# Altium project PCB_Project.PrjPcb
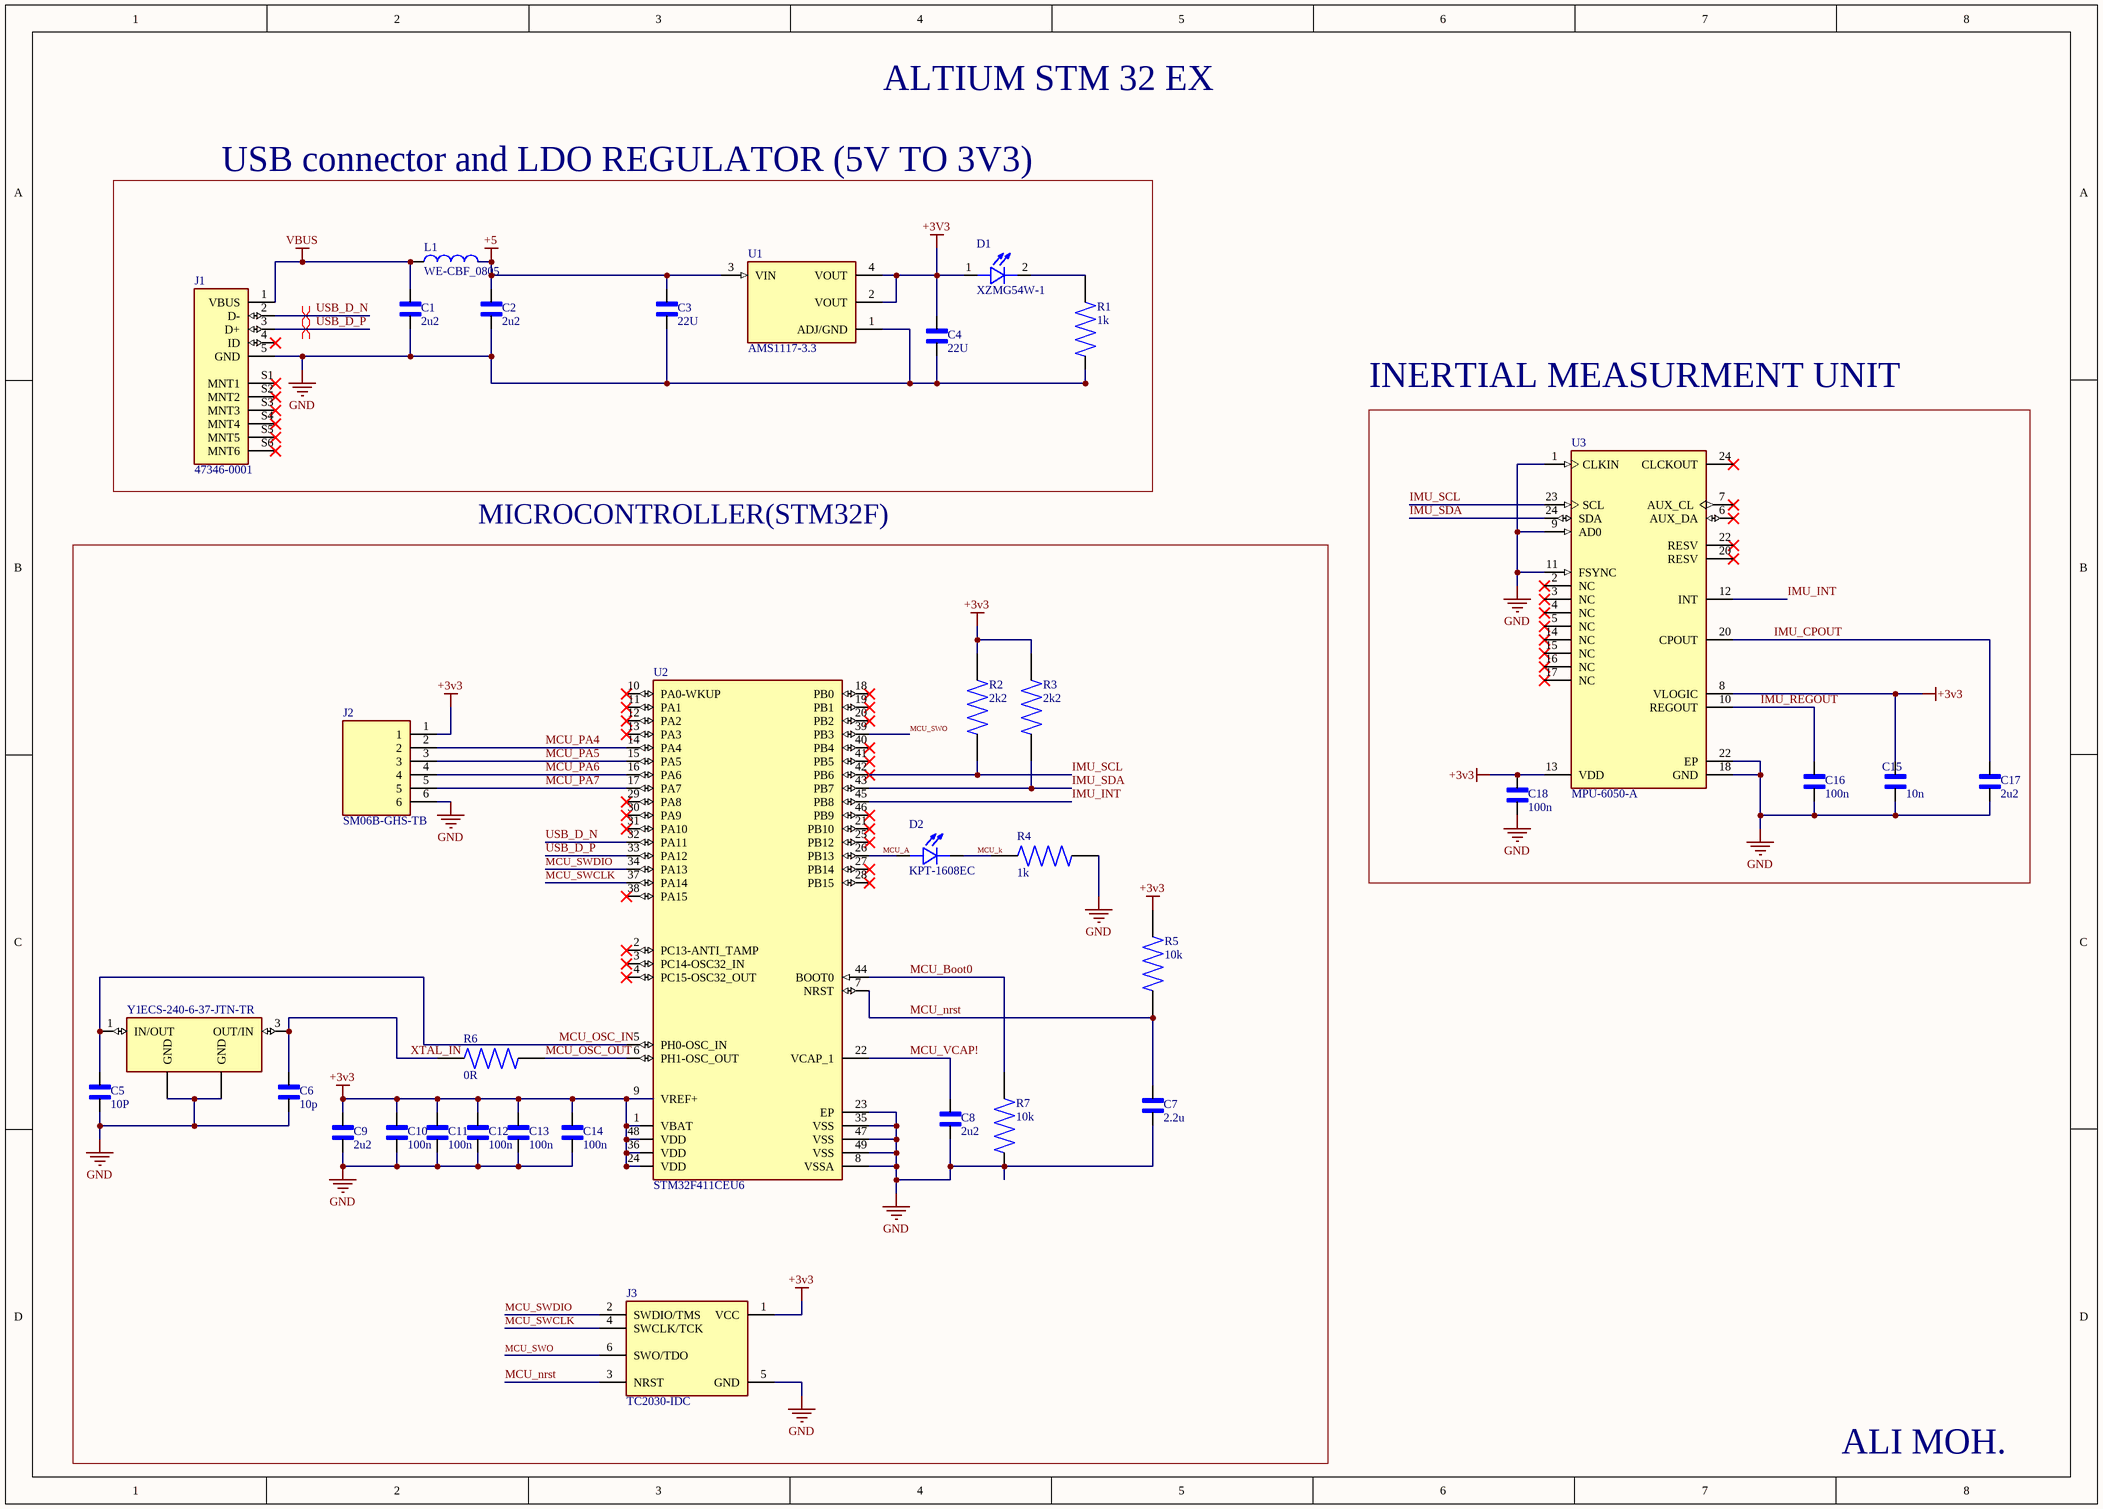
[diagram p0: Sheet1.SchDoc]
1 sheet, 35 parts. Net scope: global (net labels, ports and power ports of the same name join across sheets).
Board file: PCB1.PcbDoc

## Sheet Sheet1.SchDoc
size A3; SheetNumber: 1; SheetTotal: 1; SPICEModelCacheJLYBPXHK: <root> / <DocumentId>JLYBPXHK</DocumentId> / </root>

### Parts
C1  2u2  [CAPC1608X90]
C2  2u2  [CAPC1608X90]
C3  22U  [CAPC1608X90]
C4  22U  [CAPC1608X90]
C5  10P  [CAPC1608X90]
C6  10p  [CAPC1608X90]
C7  2.2u  [CAPC1608X90]
C8  2u2  [CAPC1608X90]
C9  2u2  [CAPC1608X90]
C10  100n  [CAPC1005X55N]
C11  100n  [CAPC1005X55N]
C12  100n  [CAPC1005X55N]
C13  100n  [CAPC1005X55N]
C14  100n  [CAPC1005X55N]
C15  10n  [CAPC1005X55N]
C16  100n  [CAPC1005X55N]
C17  2u2  [CAPC1608X90]
C18  100n  [CAPC1005X55N]
D1  XZMG54W-1  [LED_XZMG54W-1]
D2  KPT-1608EC  [LED_KPT-1608EC]
J1  47346-0001  [MOLEX_47346-0001]
J2  SM06B-GHS-TB  [JST_SM06B-GHS-TB]
J3  TC2030-IDC  [TAG-CONNECT_TC2050-IDC]
L1  WE-CBF_0805  [WE-CBF_0805_W4.0]
R1  1k  [RESC1005X37N]
R2  2k2  [RESC1005X37N]
R3  2k2  [RESC1005X37N]
R4  1k  [RESC1005X37N]
R5  10k  [RESC1005X37N]
R6  0R  [RESC1005X37N]
R7  10k  [RESC1005X37N]
U1  AMS1117-3.3  [SOT229P700X180-4N]
U2  STM32F411CEU6  [QFN50P700X700X60-49N]
U3  MPU-6050-A  [QFN50P400X400X95-24N]
Y1  ECS-240-6-37-JTN-TR  [XTAL_ECS-240-6-37-JTN-TR]

### Blocks framed on the sheet
USB connector and LDO REGULATOR (5V TO 3V3): C1-C4 D1 J1 L1 R1 U1
INERTIAL MEASURMENT UNIT: C15-C18 U3
MICROCONTROLLER(STM32F): C5-C14 D2 J2 J3 R2-R7 U2 Y1

### Nets
+3v3: C4.2 C9.2 C10.1 C11.1 C12.1 C13.1 C14.1 C15.1 C18.1 D1.1(A) J2.1 J3.1(VCC) R2.1 R3.1 R5.2 U1.2(VOUT) U1.4(VOUT) U2.1(VBAT) U2.9(VREF+) U2.24(VDD) U2.36(VDD) U2.48(VDD) U3.8(VLOGIC) U3.13(VDD)
+5: C2.2 C3.2 L1.2 U1.3(VIN)
GND: C1.1 C2.1 C3.1 C4.1 C5.1 C6.1 C7.1 C8.2 C9.1 C10.2 C11.2 C12.2 C13.2 C14.2 C15.2 C16.2 C17.2 C18.2 J1.5(GND) J2.6 J3.5(GND) R1.1 R4.1 R7.1 U1.1(ADJ/GND) U2.8(VSSA) U2.23(EP) U2.35(VSS) U2.47(VSS) U2.49(VSS) U3.1(CLKIN) U3.9(AD0) U3.11(FSYNC) U3.18(GND) U3.22(RESV) Y1.2(GND) Y1.4(GND)
VBUS: C1.2 J1.1(VBUS) L1.1
IMU_CPOUT: C17.1 U3.20(CPOUT)
IMU_INT: U2.45(PB8) U3.12(INT)
IMU_REGOUT: C16.1 U3.10(REGOUT)
IMU_SCL: R2.2 U2.42(PB6) U3.23(SCL)
IMU_SDA: R3.2 U2.43(PB7) U3.24(CLCKOUT)
MCU_A: D2.A U2.26(PB13)
MCU_Boot0: R7.2 U2.44(BOOT0)
MCU_k: D2.C R4.2
MCU_nrst: C7.2 J3.3(NRST) R5.1 U2.7(NRST)
MCU_OSC_IN: C5.2 U2.5(PH0-OSC_IN) Y1.1(IN/OUT)
MCU_OSC_OUT: R6.1 U2.6(PH1-OSC_OUT)
MCU_PA4: J2.2 U2.14(PA4)
MCU_PA5: J2.3 U2.15(PA5)
MCU_PA6: J2.4 U2.16(PA6)
MCU_PA7: J2.5 U2.17(PA7)
MCU_SWCLK: J3.4(SWCLK/TCK) U2.37(PA14)
MCU_SWDIO: J3.2(SWDIO/TMS) U2.34(PA13)
MCU_SWO: J3.6(SWO/TDO) U2.39(PB3)
MCU_VCAP!: C8.1 U2.22(VCAP_1)
USB_D_N: J1.2(D-) U2.32(PA11)
USB_D_P: J1.3(D+) U2.33(PA12)
XTAL_IN: C6.2 R6.2 Y1.3(OUT/IN)
NetD1_2: D1.2(C) R1.2

Not connected (* = marked no-connect by the designer): J1 4(ID)* S1(MNT1)* S2(MNT2)* S3(MNT3)* S4(MNT4)* S5(MNT5)* S6(MNT6)*; U2 2(PC13-ANTI_TAMP)* 3(PC14-OSC32_IN)* 4(PC15-OSC32_OUT)* 10(PA0-WKUP)* 11(PA1)* 12(PA2)* 13(PA3)* 18(PB0)* 19(PB1)* 20(PB2)* 21(PB10)* 25(PB12)* 27(PB14)* 28(PB15)* 29(PA8)* 30(PA9)* 31(PA10)* 38(PA15)* 40(PB4)* 41(PB5)* 46(PB9)*; U3 2(NC)* 3(NC)* 4(NC)* 5(NC)* 6(AUX_DA)* 7(AUX_CL)* 14(NC)* 15(NC)* 16(NC)* 17(NC)*

### Layout directives
differential pair: USB_D_N, USB_D_P

### Notes on the sheet
- ALTIUM STM 32 EX
- ALI MOH.

### Library data of the parts
C1-C4 C7-C9 C17 = CC0603KRX5R7BB225: 2.2 ÂµF Â±10% 16V Ceramic Capacitor X5R 0603 (1608 Metric); MF: Yageo; SnapEDA_Link: https://www.snapeda.com/parts/CC0603KRX5R7BB225/Yageo/view-part/?ref=snap; Package: 0603 Yageo; Value: *; MP: CC0603KRX5R7BB225; Check_prices: https://www.snapeda.com/parts/CC0603KRX5R7BB225/Yageo/view-part/?ref=eda
C5 C6 = CC0603KRX5R7BB225: 10pF Â±10% 16V Ceramic Capacitor X5R 0603 (1608 Metric); MF: Yageo; SnapEDA_Link: https://www.snapeda.com/parts/CC0603KRX5R7BB225/Yageo/view-part/?ref=snap; Package: 0603 Yageo; Value: *; MP: CC0603KRX5R7BB225; Check_prices: https://www.snapeda.com/parts/CC0603KRX5R7BB225/Yageo/view-part/?ref=eda
C10-C16 C18 = GJM1555C1HR10BB01J: SMD Capacitor C0G(EIA) with Capacitance: 0.10pF Tol. 0.1pF. Rated Voltage: 50Vdc; MF: Murata; SnapEDA_Link: https://www.snapeda.com/parts/GJM1555C1HR10BB01J/Murata/view-part/?ref=snap; Package: 1005 Taiyo Yuden; Value: *; MP: GJM1555C1HR10BB01J; Check_prices: https://www.snapeda.com/parts/GJM1555C1HR10BB01J/Murata/view-part/?ref=eda
D1 = XZMG54W-1: Green 568nm LED Indication - Discrete 2.2V 0805 (2012 Metric); MF: SunLED; SnapEDA_Link: https://www.snapeda.com/parts/XZMG54W-1/SunLED/view-part/?ref=snap; Purchase-URL: https://pricing.snapeda.com/search/part/XZMG54W-1/?ref=eda; Price: None; Availability: In Stock; Package: None; Check_prices: https://www.snapeda.com/parts/XZMG54W-1/SunLED/view-part/?ref=eda; Value: *; MP: XZMG54W-1
D2 = KPT-1608EC: Red Chip LED 1.6x0.8mm; MF: Kingbright; SnapEDA_Link: https://www.snapeda.com/parts/KPT-1608EC/Kingbright/view-part/?ref=snap; Package: Package; Value: *; MP: KPT-1608EC; Check_prices: https://www.snapeda.com/parts/KPT-1608EC/Kingbright/view-part/?ref=eda
J1 = 47346-0001: Conn Data USB Micro B w/Flange SMT Bottom Mnt LF | Molex Incorporated 47346-0001; SnapEDA_Link: https://www.snapeda.com/parts/47346-0001/Molex/view-part/?ref=snap; Package: None; Value: *; MF: Molex; MP: 47346-0001; Check_prices: https://www.snapeda.com/parts/47346-0001/Molex/view-part/?ref=eda
J2 = SM06B-GHS-TB: Connector Header Surface Mount, Right Angle 6 position 0.049 (1.25mm); MF: JST Sales; SnapEDA_Link: https://www.snapeda.com/parts/SM06B-GHS-TB/JST/view-part/?ref=snap; Package: None; Value: *; MP: SM06B-GHS-TB; Check_prices: https://www.snapeda.com/parts/SM06B-GHS-TB/JST/view-part/?ref=eda
J3 = TC2030-IDC: Cbl Plug-Of-Nails 10-Pin w/Legs; MP: TC2050-IDC; Value: *; Availability: Unavailable; Price: None; Package: None
L1 = WE-CBF_0805: FERRITE BEAD 60 OHM 0805 1LN; MF: WÃ¼rth Elektronik; MP: 742792063; SnapEDA_Link: https://www.snapeda.com/parts/742792063/W%25C3%25BCrth+Elektronik+Midcom/view-part/?ref=snap; Package: 0805 Wurth Elektronik; Value: *; Check_prices: https://www.snapeda.com/parts/742792063/W%25C3%25BCrth+Elektronik+Midcom/view-part/?ref=eda
R1-R4 = CR0402AFX-1002GAS: Resistor, AS 0402 1k 1% 63mW TC100 | Bourns CR0402AFX-1002GAS; SnapEDA_Link: https://www.snapeda.com/parts/CR0402AFX-1002GAS/Bourns/view-part/?ref=snap; Package: 0402-2 Bourns; Value: *; MF: Bourns; MP: CR0402AFX-1002GAS; Check_prices: https://www.snapeda.com/parts/CR0402AFX-1002GAS/Bourns/view-part/?ref=eda
R5 R7 = CR0402AFX-1002GAS: Resistor, AS 0402 10k 1% 63mW TC100 | Bourns CR0402AFX-1002GAS; SnapEDA_Link: https://www.snapeda.com/parts/CR0402AFX-1002GAS/Bourns/view-part/?ref=snap; Package: 0402-2 Bourns; Value: *; MF: Bourns; MP: CR0402AFX-1002GAS; Check_prices: https://www.snapeda.com/parts/CR0402AFX-1002GAS/Bourns/view-part/?ref=eda
R6 = CR0402AFX-1002GAS: Resistor, AS 0402 0R 1% 63mW TC100 | Bourns CR0402AFX-1002GAS; SnapEDA_Link: https://www.snapeda.com/parts/CR0402AFX-1002GAS/Bourns/view-part/?ref=snap; Package: 0402-2 Bourns; Value: *; MF: Bourns; MP: CR0402AFX-1002GAS; Check_prices: https://www.snapeda.com/parts/CR0402AFX-1002GAS/Bourns/view-part/?ref=eda
U1 = AMS1117-3.3: Linear Voltage Regulator IC Positive Fixed 1 Output 1A SOT-223-3L; MF: UMW; SnapEDA_Link: https://www.snapeda.com/parts/AMS1117-3.3/UMW/view-part/?ref=snap; Package: SOT-223-3L UMW; Value: *; MP: AMS1117-3.3; Check_prices: https://www.snapeda.com/parts/AMS1117-3.3/UMW/view-part/?ref=eda
U2 = STM32F411CEU6: High-performance access line, ARM Cortex-M4 core with DSP and FPU, 512 Kbytes Flash, 100 MHz CPU, ART Accelerator; Package: None; Availability: Unavailable; Value: *; MP: STM32F411CEU6; Price: None
U3 = MPU-6050-A: MF: TDK InvenSense; SnapEDA_Link: https://www.snapeda.com/parts/MPU-6050-A/InvenSense/view-part/?ref=snap; Package: None; Value: *; MP: MPU-6050-A; Check_prices: https://www.snapeda.com/parts/MPU-6050-A/InvenSense/view-part/?ref=eda
Y1 = ECS-240-6-37-JTN-TR: 24 MHz Â±20ppm Crystal 6pF 80 Ohms 4-SMD, No Lead; MF: ECS Inc.; SnapEDA_Link: https://www.snapeda.com/parts/ECS-240-6-37-JTN-TR/ECS/view-part/?ref=snap; Package: ECX-1637-37-4 ECS; Value: *; MP: ECS-240-6-37-JTN-TR; Check_prices: https://www.snapeda.com/parts/ECS-240-6-37-JTN-TR/ECS/view-part/?ref=eda